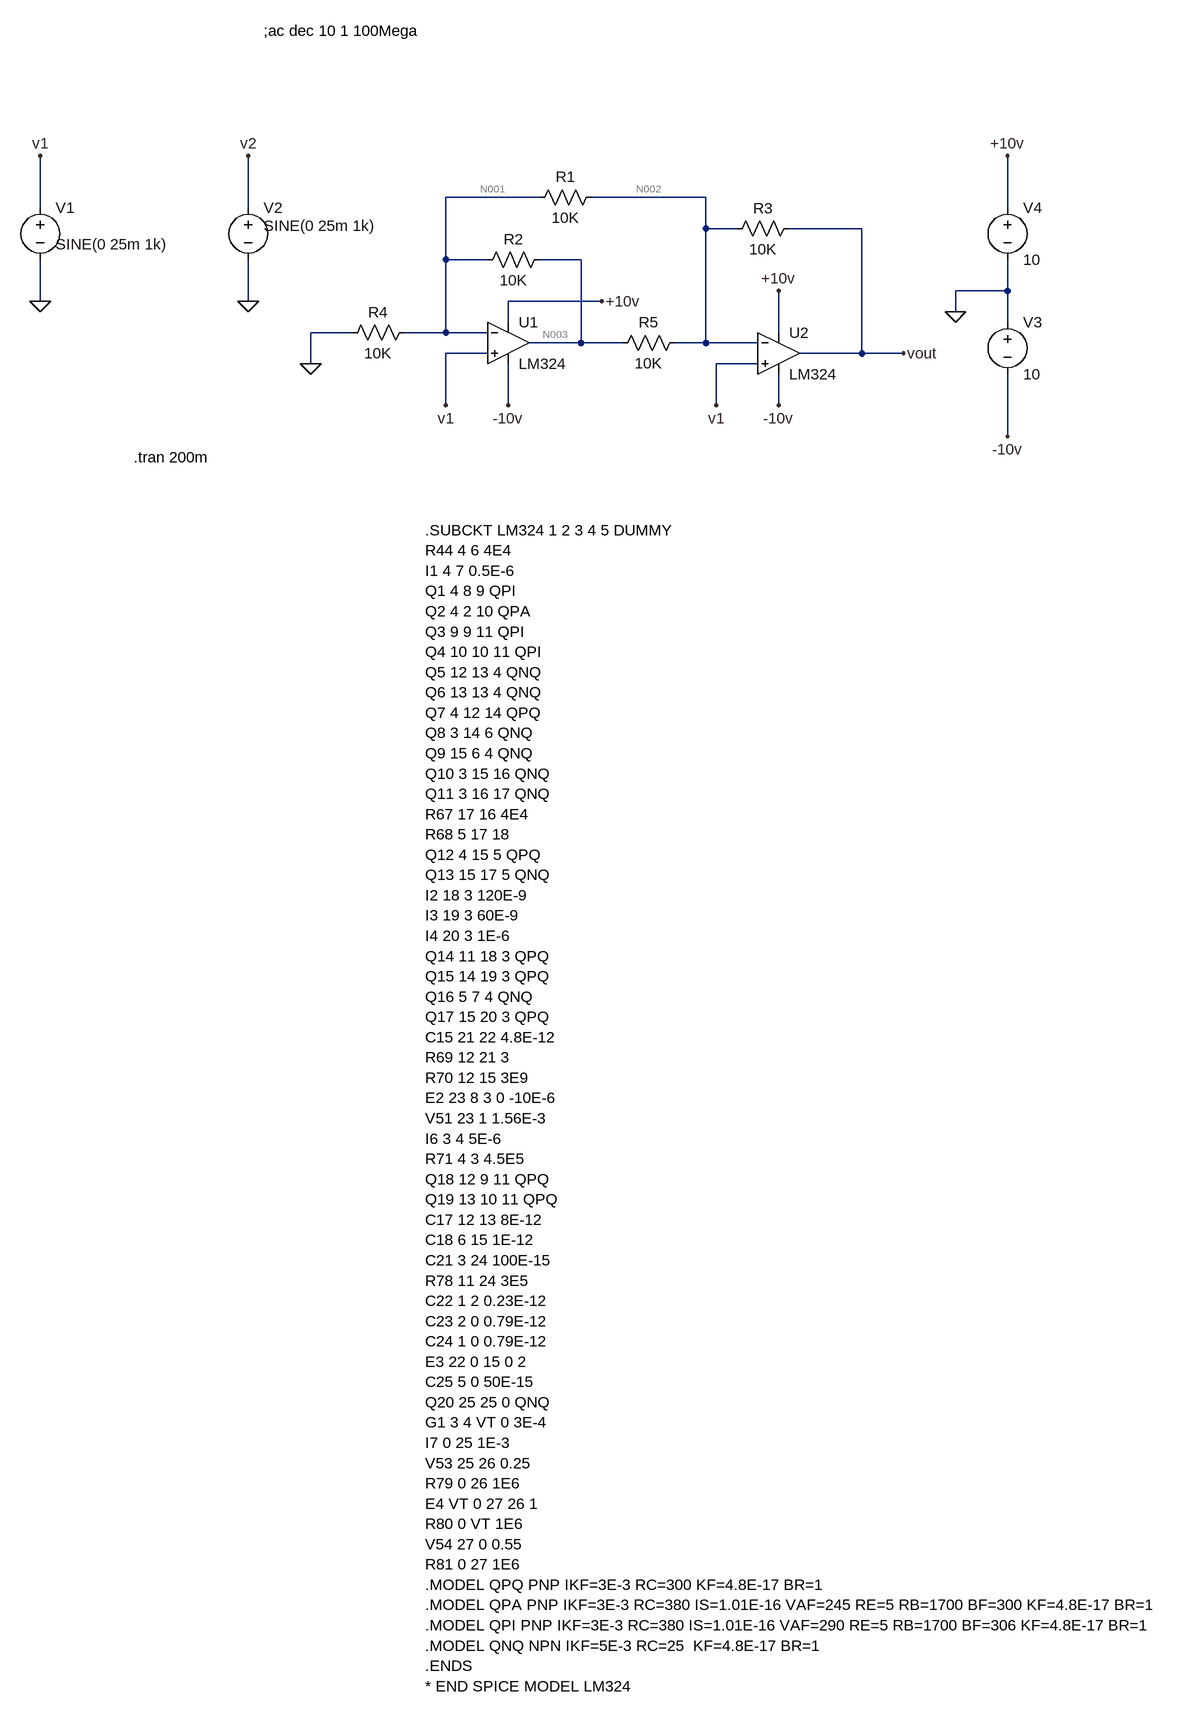
[diagram p0: schematic Laboratorio n° 1 - Circuito 1.asc]
Laboratorio n° 1 - Circuito 1.asc, the LTspice schematic file:
Version 4
SHEET 1 1452 1996
WIRE 384 -128 240 -128
WIRE 640 -128 464 -128
WIRE -384 -112 -384 -192
WIRE -64 -112 -64 -192
WIRE 1104 -112 1104 -192
WIRE 640 -80 640 -128
WIRE 688 -80 640 -80
WIRE 880 -80 768 -80
WIRE 240 -32 240 -128
WIRE 304 -32 240 -32
WIRE 448 -32 384 -32
WIRE 1104 16 1104 -32
WIRE 1104 16 1024 16
WIRE -384 32 -384 -32
WIRE -64 32 -64 -32
WIRE 480 32 336 32
WIRE 1024 48 1024 16
WIRE 336 64 336 32
WIRE 1104 64 1104 16
WIRE 96 80 32 80
WIRE 240 80 240 -32
WIRE 240 80 176 80
WIRE 304 80 240 80
WIRE 752 80 752 16
WIRE 448 96 448 -32
WIRE 448 96 368 96
WIRE 512 96 448 96
WIRE 640 96 640 -80
WIRE 640 96 592 96
WIRE 720 96 640 96
WIRE 304 112 240 112
WIRE 880 112 880 -80
WIRE 880 112 784 112
WIRE 944 112 880 112
WIRE 32 128 32 80
WIRE 720 128 656 128
WIRE 240 192 240 112
WIRE 336 192 336 128
WIRE 656 192 656 128
WIRE 752 192 752 144
WIRE 1104 240 1104 144
FLAG 32 128 0
FLAG -64 32 0
FLAG -384 -192 v1
FLAG -64 -192 v2
FLAG 944 112 vout
FLAG 1104 -192 +10v
FLAG 1104 240 -10v
FLAG 1024 48 0
FLAG 480 32 +10v
FLAG 336 192 -10v
FLAG 752 16 +10v
FLAG 752 192 -10v
FLAG -384 32 0
FLAG 656 192 v1
FLAG 240 192 v1
SYMBOL res 368 -112 R270
WINDOW 0 32 56 VTop 2
WINDOW 3 0 56 VBottom 2
SYMATTR InstName R1
SYMATTR Value 10K
SYMBOL res 288 -16 R270
WINDOW 0 32 56 VTop 2
WINDOW 3 0 56 VBottom 2
SYMATTR InstName R2
SYMATTR Value 10K
SYMBOL res 672 -64 R270
WINDOW 0 32 56 VTop 2
WINDOW 3 0 56 VBottom 2
SYMATTR InstName R3
SYMATTR Value 10K
SYMBOL res 192 64 R90
WINDOW 0 0 56 VBottom 2
WINDOW 3 32 56 VTop 2
SYMATTR InstName R4
SYMATTR Value 10K
SYMBOL res 608 80 R90
WINDOW 0 0 56 VBottom 2
WINDOW 3 32 56 VTop 2
SYMATTR InstName R5
SYMATTR Value 10K
SYMBOL voltage -384 -128 R0
WINDOW 123 24 44 Left 2
WINDOW 39 0 0 Left 0
WINDOW 3 24 72 Left 2
SYMATTR InstName V1
SYMATTR Value SINE(0 25m 1k)
SYMBOL voltage -64 -128 R0
WINDOW 123 24 44 Left 2
WINDOW 39 0 0 Left 0
WINDOW 3 24 44 Left 2
SYMATTR InstName V2
SYMATTR Value SINE(0 25m 1k)
SYMBOL voltage 1104 48 R0
WINDOW 123 0 0 Left 0
WINDOW 39 0 0 Left 0
SYMATTR InstName V3
SYMATTR Value 10
SYMBOL voltage 1104 -128 R0
WINDOW 123 0 0 Left 0
WINDOW 39 0 0 Left 0
SYMATTR InstName V4
SYMATTR Value 10
SYMBOL OpAmps\\UniversalOpAmp 336 96 R0
SYMATTR InstName U1
SYMATTR Value LM324
SYMBOL OpAmps\\UniversalOpAmp 752 112 R0
SYMATTR InstName U2
SYMATTR Value LM324
TEXT -240 272 Left 2 !.tran 200m
TEXT 208 384 Left 2 !.SUBCKT LM324 1 2 3 4 5 DUMMY\nR44 4 6 4E4\nI1 4 7 0.5E-6\nQ1 4 8 9 QPI\nQ2 4 2 10 QPA\nQ3 9 9 11 QPI\nQ4 10 10 11 QPI\nQ5 12 13 4 QNQ\nQ6 13 13 4 QNQ\nQ7 4 12 14 QPQ\nQ8 3 14 6 QNQ\nQ9 15 6 4 QNQ\nQ10 3 15 16 QNQ\nQ11 3 16 17 QNQ\nR67 17 16 4E4\nR68 5 17 18\nQ12 4 15 5 QPQ\nQ13 15 17 5 QNQ\nI2 18 3 120E-9\nI3 19 3 60E-9\nI4 20 3 1E-6\nQ14 11 18 3 QPQ\nQ15 14 19 3 QPQ\nQ16 5 7 4 QNQ\nQ17 15 20 3 QPQ\nC15 21 22 4.8E-12\nR69 12 21 3\nR70 12 15 3E9\nE2 23 8 3 0 -10E-6\nV51 23 1 1.56E-3\nI6 3 4 5E-6\nR71 4 3 4.5E5\nQ18 12 9 11 QPQ\nQ19 13 10 11 QPQ\nC17 12 13 8E-12\nC18 6 15 1E-12\nC21 3 24 100E-15\nR78 11 24 3E5\nC22 1 2 0.23E-12\nC23 2 0 0.79E-12\nC24 1 0 0.79E-12\nE3 22 0 15 0 2\nC25 5 0 50E-15\nQ20 25 25 0 QNQ\nG1 3 4 VT 0 3E-4\nI7 0 25 1E-3\nV53 25 26 0.25\nR79 0 26 1E6\nE4 VT 0 27 26 1\nR80 0 VT 1E6\nV54 27 0 0.55\nR81 0 27 1E6\n.MODEL QPQ PNP IKF=3E-3 RC=300 KF=4.8E-17 BR=1\n.MODEL QPA PNP IKF=3E-3 RC=380 IS=1.01E-16 VAF=245 RE=5 RB=1700 BF=300 KF=4.8E-17 BR=1\n.MODEL QPI PNP IKF=3E-3 RC=380 IS=1.01E-16 VAF=290 RE=5 RB=1700 BF=306 KF=4.8E-17 BR=1\n.MODEL QNQ NPN IKF=5E-3 RC=25  KF=4.8E-17 BR=1\n.ENDS\n* END SPICE MODEL LM324
TEXT -40 -384 Left 2 !;ac dec 10 1 100Mega

The netlist it stands for:
* Laboratorio n° 1 - Circuito 1.asc
R1 N001 N002 10K
R2 N001 N003 10K
R3 N002 vout 10K
R4 N001 0 10K
R5 N002 N003 10K
V1 v1 0 SINE(0 25m 1k)
V2 v2 0 SINE(0 25m 1k)
V3 0 -10v 10
V4 +10v 0 10
XU1 v1 N001 +10v -10v N003 level1 LM324 Avol=1Meg GBW=10Meg Vos=0 En=0 Enk=0 In=0 Ink=0 Rin=500Meg  ; pins In+ In- V+ V- OUT
XU2 v1 N002 +10v -10v vout level1 LM324 Avol=1Meg GBW=10Meg Vos=0 En=0 Enk=0 In=0 Ink=0 Rin=500Meg  ; pins In+ In- V+ V- OUT
.tran 200m
.SUBCKT LM324 1 2 3 4 5 DUMMY
R44 4 6 4E4
I1 4 7 0.5E-6
Q1 4 8 9 QPI
Q2 4 2 10 QPA
Q3 9 9 11 QPI
Q4 10 10 11 QPI
Q5 12 13 4 QNQ
Q6 13 13 4 QNQ
Q7 4 12 14 QPQ
Q8 3 14 6 QNQ
Q9 15 6 4 QNQ
Q10 3 15 16 QNQ
Q11 3 16 17 QNQ
R67 17 16 4E4
R68 5 17 18
Q12 4 15 5 QPQ
Q13 15 17 5 QNQ
I2 18 3 120E-9
I3 19 3 60E-9
I4 20 3 1E-6
Q14 11 18 3 QPQ
Q15 14 19 3 QPQ
Q16 5 7 4 QNQ
Q17 15 20 3 QPQ
C15 21 22 4.8E-12
R69 12 21 3
R70 12 15 3E9
E2 23 8 3 0 -10E-6
V51 23 1 1.56E-3
I6 3 4 5E-6
R71 4 3 4.5E5
Q18 12 9 11 QPQ
Q19 13 10 11 QPQ
C17 12 13 8E-12
C18 6 15 1E-12
C21 3 24 100E-15
R78 11 24 3E5
C22 1 2 0.23E-12
C23 2 0 0.79E-12
C24 1 0 0.79E-12
E3 22 0 15 0 2
C25 5 0 50E-15
Q20 25 25 0 QNQ
G1 3 4 VT 0 3E-4
I7 0 25 1E-3
V53 25 26 0.25
R79 0 26 1E6
E4 VT 0 27 26 1
R80 0 VT 1E6
V54 27 0 0.55
R81 0 27 1E6
.MODEL QPQ PNP IKF=3E-3 RC=300 KF=4.8E-17 BR=1
.MODEL QPA PNP IKF=3E-3 RC=380 IS=1.01E-16 VAF=245 RE=5 RB=1700 BF=300 KF=4.8E-17 BR=1
.MODEL QPI PNP IKF=3E-3 RC=380 IS=1.01E-16 VAF=290 RE=5 RB=1700 BF=306 KF=4.8E-17 BR=1
.MODEL QNQ NPN IKF=5E-3 RC=25  KF=4.8E-17 BR=1
.ENDS
* END SPICE MODEL LM324
;ac dec 10 1 100Mega
.lib UniversalOpAmp1.lib
.backanno
.end

* Results of the author's LTspice run, read from the files saved beside the schematic
* Operating Point, zero values left out:
*   V(n001) = -288.5 µV
*   V(n002) = -288.5 µV
*   V(n003) = -675.4 µV
*   V(vout) = -18.1 nV
*   V(-10v) = -10 V
*   V(+10v) = 10 V
*   I(R2) = 38.69 nA
*   I(R3) = -28.85 nA
*   I(R4) = -28.85 nA
*   I(R5) = 38.69 nA
*   I(V1) = 18.64 nA
*   I(V3) = -477.3 µA
*   I(V4) = -477.3 µA
*   Ix(u1:1) = -9.319 nA
*   Ix(u1:2) = -9.84 nA
*   Ix(u1:3) = 238.6 µA
*   Ix(u1:4) = -238.7 µA
*   Ix(u1:5) = 77.38 nA
*   Ix(u2:1) = -9.319 nA
*   Ix(u2:2) = -9.84 nA
*   Ix(u2:3) = 238.7 µA
*   Ix(u2:4) = -238.7 µA
*   Ix(u2:5) = -28.85 nA
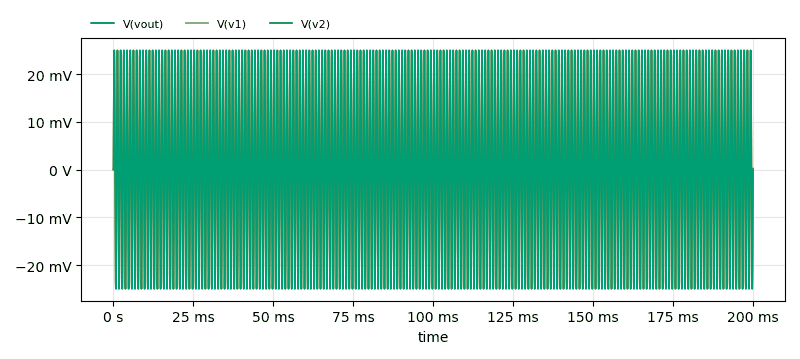
[diagram p1: Transient Analysis of Laboratorio n° 1 - Circuito 1.asc, plotted from the saved traces]
* Transient Analysis, 1 run:
*   V(vout): min -223 µV, max 239.5 µV, average -32.28 nV, rms 160.8 µV, last 234.5 µV
*   V(v1): min -24.99 mV, max 24.99 mV, average 39.21 nV, rms 17.97 mV, last 0 V
*   V(v2): min -24.99 mV, max 24.99 mV, average 39.21 nV, rms 17.97 mV, last 0 V